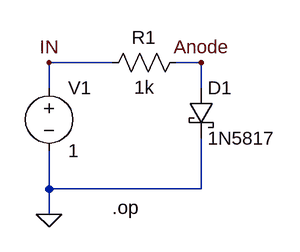
[diagram p0: schematic DCOperatingPoint.asc]
DCOperatingPoint.asc, the LTspice schematic file:
Version 4
SHEET 1 2084 680
WIRE 944 240 864 240
WIRE 1056 240 1024 240
WIRE 864 272 864 240
WIRE 1056 272 1056 240
WIRE 864 400 864 352
WIRE 1056 400 1056 336
WIRE 1056 400 864 400
WIRE 864 432 864 400
FLAG 864 432 0
FLAG 864 240 IN
FLAG 1056 240 Anode
SYMBOL voltage 864 256 R0
WINDOW 123 0 0 Left 2
WINDOW 39 0 0 Left 2
SYMATTR InstName V1
SYMATTR Value 1
SYMBOL res 928 256 R270
WINDOW 0 32 56 VTop 2
WINDOW 3 0 56 VBottom 2
SYMATTR InstName R1
SYMATTR Value 1k
SYMBOL schottky 1040 272 R0
SYMATTR InstName D1
SYMATTR Value 1N5817
SYMATTR Description Diode
SYMATTR Type diode
TEXT 944 424 Left 2 !.op

The netlist it stands for:
* DCOperatingPoint.asc
V1 IN 0 1
R1 IN Anode 1k
D1 Anode 0 1N5817
.model D D
.lib standard.dio
.op
.backanno
.end

* Results of the author's LTspice run, read from the files saved beside the schematic
* Operating Point:
*   V(in) = 1 V
*   V(anode) = 119.4 mV
*   I(D1) = 880.6 µA
*   I(R1) = 880.6 µA
*   I(V1) = -880.6 µA